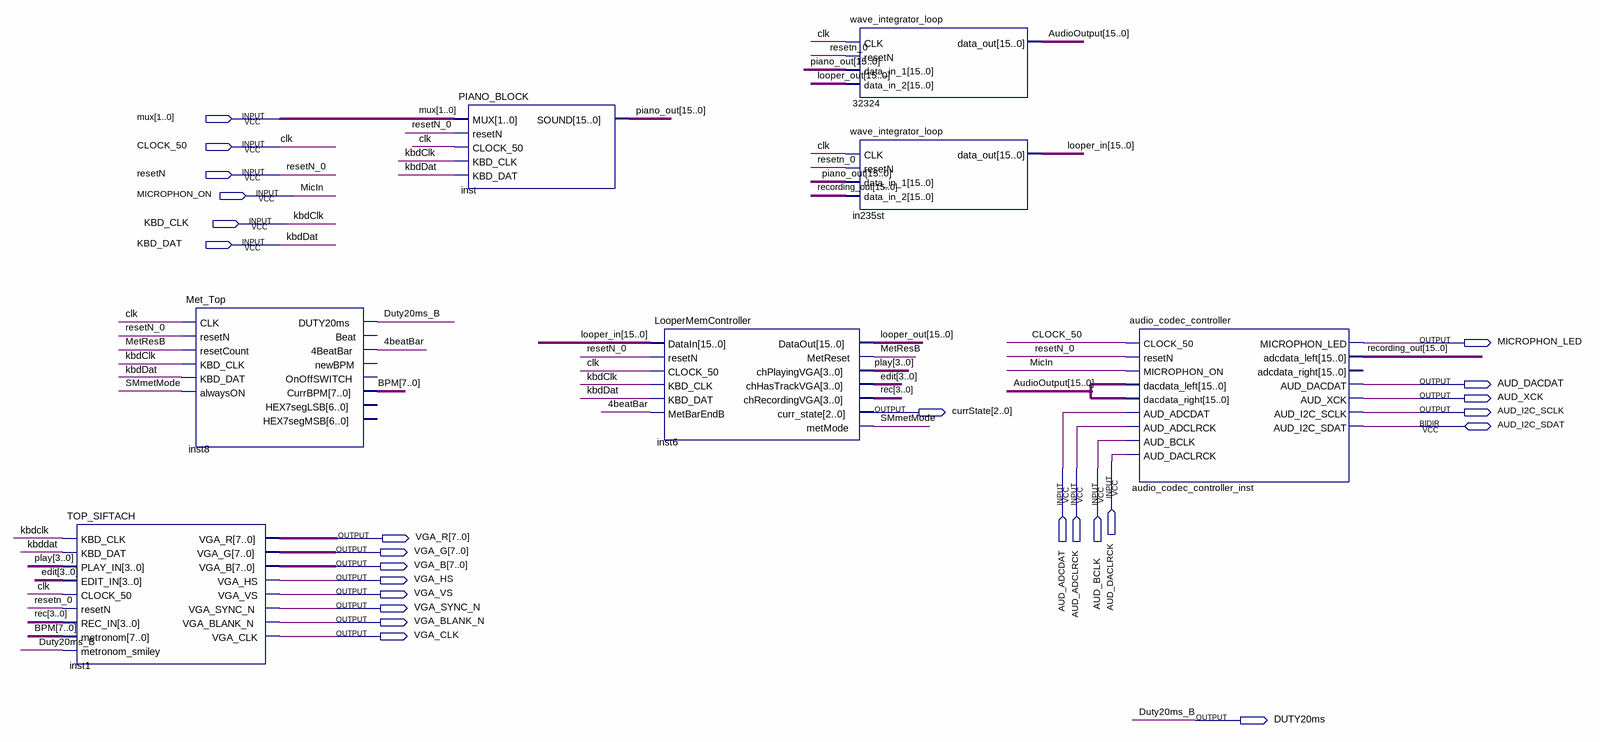
[diagram p0: schematic sheet]
// Quartus schematic TOP.bdf as structural Verilog: 7 symbols, 25 pins
module TOP (
  input  [1:0] mux,
  input  CLOCK_50,
  input  resetN,
  input  MICROPHON_ON,
  input  KBD_CLK,
  input  KBD_DAT,
  input  AUD_DACLRCK,
  input  AUD_ADCDAT,
  input  AUD_ADCLRCK,
  input  AUD_BCLK,
  inout  AUD_I2C_SDAT,
  output MICROPHON_LED,
  output AUD_DACDAT,
  output AUD_XCK,
  output [2:0] currState,
  output AUD_I2C_SCLK,
  output [7:0] VGA_R,
  output [7:0] VGA_G,
  output [7:0] VGA_B,
  output VGA_HS,
  output VGA_VS,
  output VGA_SYNC_N,
  output VGA_BLANK_N,
  output VGA_CLK,
  output DUTY20ms
);

  wire \4beatBar , MetResB, SMmetMode;
  wire [3:0] edit, play, rec;
  wire [7:0] BPM;
  wire [15:0] AudioOutput, looper_in, looper_out, piano_out, recording_out;

  TOP_SIFTACH inst1 (
    .KBD_CLK(KBD_CLK), .KBD_DAT(KBD_DAT), .PLAY_IN(play), .EDIT_IN(edit), .CLOCK_50(CLOCK_50),
    .resetN(resetN), .REC_IN(rec), .metronom(BPM), .metronom_smiley(DUTY20ms), .VGA_R(VGA_R), .VGA_G(VGA_G),
    .VGA_B(VGA_B), .VGA_HS(VGA_HS), .VGA_VS(VGA_VS), .VGA_SYNC_N(VGA_SYNC_N), .VGA_BLANK_N(VGA_BLANK_N),
    .VGA_CLK(VGA_CLK));
  Met_Top inst8 (
    .CLK(CLOCK_50), .resetN(resetN), .resetCount(MetResB), .KBD_CLK(KBD_CLK), .KBD_DAT(KBD_DAT),
    .alwaysON(SMmetMode), .DUTY20ms(DUTY20ms), .\4BeatBar (\4beatBar ), .CurrBPM(BPM));  // open: Beat, newBPM, OnOffSWITCH, HEX7segLSB, HEX7segMSB
  PIANO_BLOCK inst (
    .MUX(mux), .resetN(resetN), .CLOCK_50(CLOCK_50), .KBD_CLK(KBD_CLK), .KBD_DAT(KBD_DAT), .SOUND(piano_out));
  LooperMemController inst6 (
    .DataIn(looper_in), .resetN(resetN), .CLOCK_50(CLOCK_50), .KBD_CLK(KBD_CLK), .KBD_DAT(KBD_DAT),
    .MetBarEndB(\4beatBar ), .DataOut(looper_out), .MetReset(MetResB), .chPlayingVGA(play),
    .chHasTrackVGA(edit), .chRecordingVGA(rec), .curr_state(currState), .metMode(SMmetMode));
  wave_integrator_loop u_32324 (
    .CLK(CLOCK_50), .resetN(resetN), .data_in_1(piano_out), .data_in_2(looper_out), .data_out(AudioOutput));
  wave_integrator_loop in235st (
    .CLK(CLOCK_50), .resetN(resetN), .data_in_1(piano_out), .data_in_2(recording_out), .data_out(looper_in));
  audio_codec_controller audio_codec_controller_inst (
    .CLOCK_50(CLOCK_50), .resetN(resetN), .MICROPHON_ON(MICROPHON_ON), .dacdata_left(AudioOutput),
    .dacdata_right(AudioOutput), .AUD_ADCDAT(AUD_ADCDAT), .AUD_ADCLRCK(AUD_ADCLRCK), .AUD_BCLK(AUD_BCLK),
    .AUD_DACLRCK(AUD_DACLRCK), .MICROPHON_LED(MICROPHON_LED), .adcdata_left(recording_out),
    .AUD_DACDAT(AUD_DACDAT), .AUD_XCK(AUD_XCK), .AUD_I2C_SCLK(AUD_I2C_SCLK), .AUD_I2C_SDAT(AUD_I2C_SDAT));  // open: adcdata_right

  // Other names for the same wires on the sheet: clk = CLOCK_50; Duty20ms_B = DUTY20ms; kbdClk = KBD_CLK;
  //   kbdDat = KBD_DAT; MicIn = MICROPHON_ON; resetN_0 = resetN
endmodule
